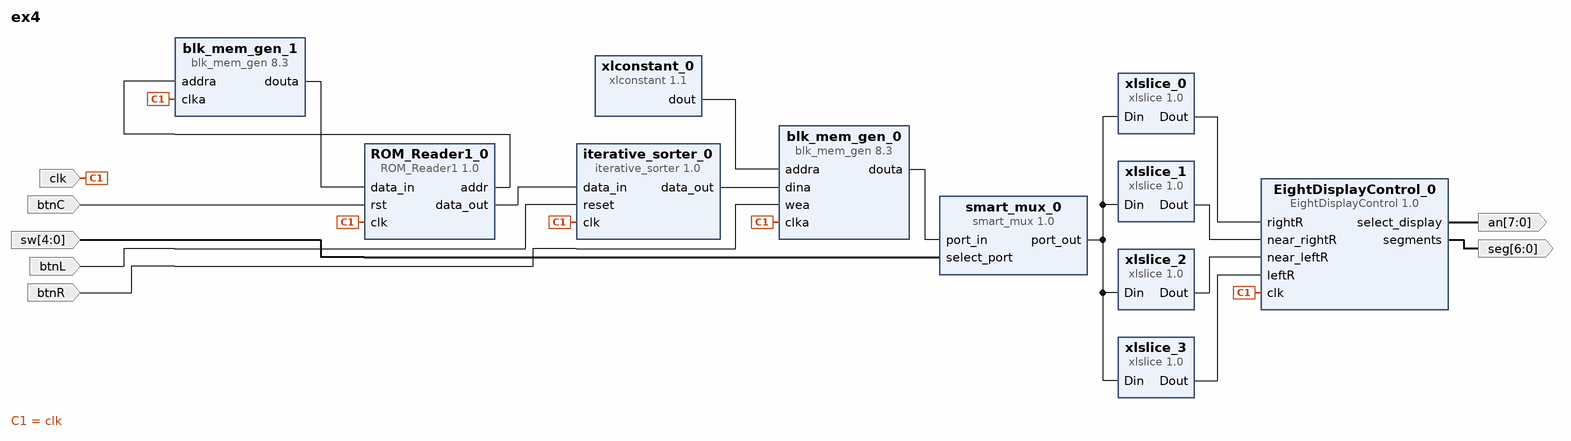
[diagram p0: block diagram of the top level]
# Vivado block design ex4, Vivado 2015.4
create_bd_design ex4

create_bd_port -dir I clk
create_bd_port -dir O -from 6 -to 0 seg
create_bd_port -dir O -from 7 -to 0 an
create_bd_port -dir I btnC
create_bd_port -dir I -from 4 -to 0 sw
create_bd_port -dir I btnL
create_bd_port -dir I btnR

create_bd_cell -type ip -vlnv xilinx.com:ip:blk_mem_gen:8.3 blk_mem_gen_1
set_property -dict [list \
  CONFIG.Memory_Type Single_Port_ROM \
  CONFIG.Enable_32bit_Address false \
  CONFIG.Write_Width_A 16 \
  CONFIG.Write_Depth_A 32 \
  CONFIG.Enable_A Always_Enabled \
  CONFIG.Register_PortA_Output_of_Memory_Primitives false \
  CONFIG.Load_Init_File true \
  CONFIG.Coe_File ../../../../../../../Projects2016/32words_16bits.coe \
  CONFIG.Use_RSTA_Pin false \
  CONFIG.Port_A_Write_Rate 0 \
  CONFIG.use_bram_block Stand_Alone \
] [get_bd_cells blk_mem_gen_1]
create_bd_cell -type ip -vlnv ua.pt:user:EightDisplayControl:1.0 EightDisplayControl_0
create_bd_cell -type ip -vlnv user.org:user:ROM_Reader1:1.0 ROM_Reader1_0
set_property -dict {CONFIG.data_width 16 CONFIG.address_bits 5} [get_bd_cells ROM_Reader1_0]
create_bd_cell -type ip -vlnv user.org:user:smart_mux:1.0 smart_mux_0
set_property -dict {CONFIG.addres_bits 5} [get_bd_cells smart_mux_0]
create_bd_cell -type ip -vlnv xilinx.com:ip:xlslice:1.0 xlslice_0
set_property -dict {CONFIG.DOUT_WIDTH 4 CONFIG.DIN_TO 0 CONFIG.DIN_FROM 3 CONFIG.DIN_WIDTH 16} [get_bd_cells xlslice_0]
create_bd_cell -type ip -vlnv xilinx.com:ip:xlslice:1.0 xlslice_1
set_property -dict {CONFIG.DOUT_WIDTH 4 CONFIG.DIN_TO 4 CONFIG.DIN_FROM 7 CONFIG.DIN_WIDTH 16} [get_bd_cells xlslice_1]
create_bd_cell -type ip -vlnv xilinx.com:ip:xlslice:1.0 xlslice_2
set_property -dict {CONFIG.DOUT_WIDTH 4 CONFIG.DIN_TO 8 CONFIG.DIN_FROM 11 CONFIG.DIN_WIDTH 16} [get_bd_cells xlslice_2]
create_bd_cell -type ip -vlnv xilinx.com:ip:xlslice:1.0 xlslice_3
set_property -dict {CONFIG.DOUT_WIDTH 4 CONFIG.DIN_TO 12 CONFIG.DIN_FROM 15 CONFIG.DIN_WIDTH 16} [get_bd_cells xlslice_3]
create_bd_cell -type ip -vlnv user.org:user:iterative_sorter:1.0 iterative_sorter_0
set_property -dict {CONFIG.word_length 16} [get_bd_cells iterative_sorter_0]
create_bd_cell -type ip -vlnv xilinx.com:ip:blk_mem_gen:8.3 blk_mem_gen_0
set_property -dict [list \
  CONFIG.Memory_Type True_Dual_Port_RAM \
  CONFIG.Enable_32bit_Address false \
  CONFIG.Use_Byte_Write_Enable false \
  CONFIG.Write_Width_A 512 \
  CONFIG.Read_Width_A 512 \
  CONFIG.Enable_A Always_Enabled \
  CONFIG.Write_Width_B 512 \
  CONFIG.Read_Width_B 512 \
  CONFIG.Enable_B Use_ENB_Pin \
  CONFIG.Register_PortA_Output_of_Memory_Primitives false \
  CONFIG.Register_PortB_Output_of_Memory_Primitives false \
  CONFIG.Fill_Remaining_Memory_Locations true \
  CONFIG.Use_RSTA_Pin false \
  CONFIG.Port_B_Clock 100 \
  CONFIG.Port_B_Write_Rate 50 \
  CONFIG.Port_B_Enable_Rate 100 \
  CONFIG.use_bram_block Stand_Alone \
] [get_bd_cells blk_mem_gen_0]
create_bd_cell -type ip -vlnv xilinx.com:ip:xlconstant:1.1 xlconstant_0
set_property -dict {CONFIG.CONST_WIDTH 13 CONFIG.CONST_VAL 0} [get_bd_cells xlconstant_0]

# ---- connections ----

connect_bd_net [get_bd_ports clk] \
  [get_bd_pins blk_mem_gen_1/clka] [get_bd_pins EightDisplayControl_0/clk] [get_bd_pins ROM_Reader1_0/clk] \
  [get_bd_pins iterative_sorter_0/clk] [get_bd_pins blk_mem_gen_0/clka]
connect_bd_net [get_bd_pins EightDisplayControl_0/segments] [get_bd_ports seg]
connect_bd_net [get_bd_pins EightDisplayControl_0/select_display] [get_bd_ports an]
connect_bd_net [get_bd_pins ROM_Reader1_0/addr] [get_bd_pins blk_mem_gen_1/addra]
connect_bd_net [get_bd_pins blk_mem_gen_1/douta] [get_bd_pins ROM_Reader1_0/data_in]
connect_bd_net [get_bd_ports sw] [get_bd_pins smart_mux_0/select_port]
connect_bd_net [get_bd_pins xlslice_0/Dout] [get_bd_pins EightDisplayControl_0/rightR]
connect_bd_net [get_bd_pins xlslice_1/Dout] [get_bd_pins EightDisplayControl_0/near_rightR]
connect_bd_net [get_bd_pins xlslice_2/Dout] [get_bd_pins EightDisplayControl_0/near_leftR]
connect_bd_net [get_bd_pins xlslice_3/Dout] [get_bd_pins EightDisplayControl_0/leftR]
connect_bd_net [get_bd_pins smart_mux_0/port_out] \
  [get_bd_pins xlslice_1/Din] [get_bd_pins xlslice_0/Din] [get_bd_pins xlslice_2/Din] [get_bd_pins xlslice_3/Din]
connect_bd_net [get_bd_pins ROM_Reader1_0/data_out] [get_bd_pins iterative_sorter_0/data_in]
connect_bd_net [get_bd_ports btnC] [get_bd_pins ROM_Reader1_0/rst]
connect_bd_net [get_bd_ports btnL] [get_bd_pins iterative_sorter_0/reset]
connect_bd_net [get_bd_pins xlconstant_0/dout] [get_bd_pins blk_mem_gen_0/addra]
connect_bd_net [get_bd_pins iterative_sorter_0/data_out] [get_bd_pins blk_mem_gen_0/dina]
connect_bd_net [get_bd_ports btnR] [get_bd_pins blk_mem_gen_0/wea]
connect_bd_net [get_bd_pins blk_mem_gen_0/douta] [get_bd_pins smart_mux_0/port_in]

validate_bd_design
save_bd_design
